# EAGLE schematic covox (EAGLE 7.3.0)
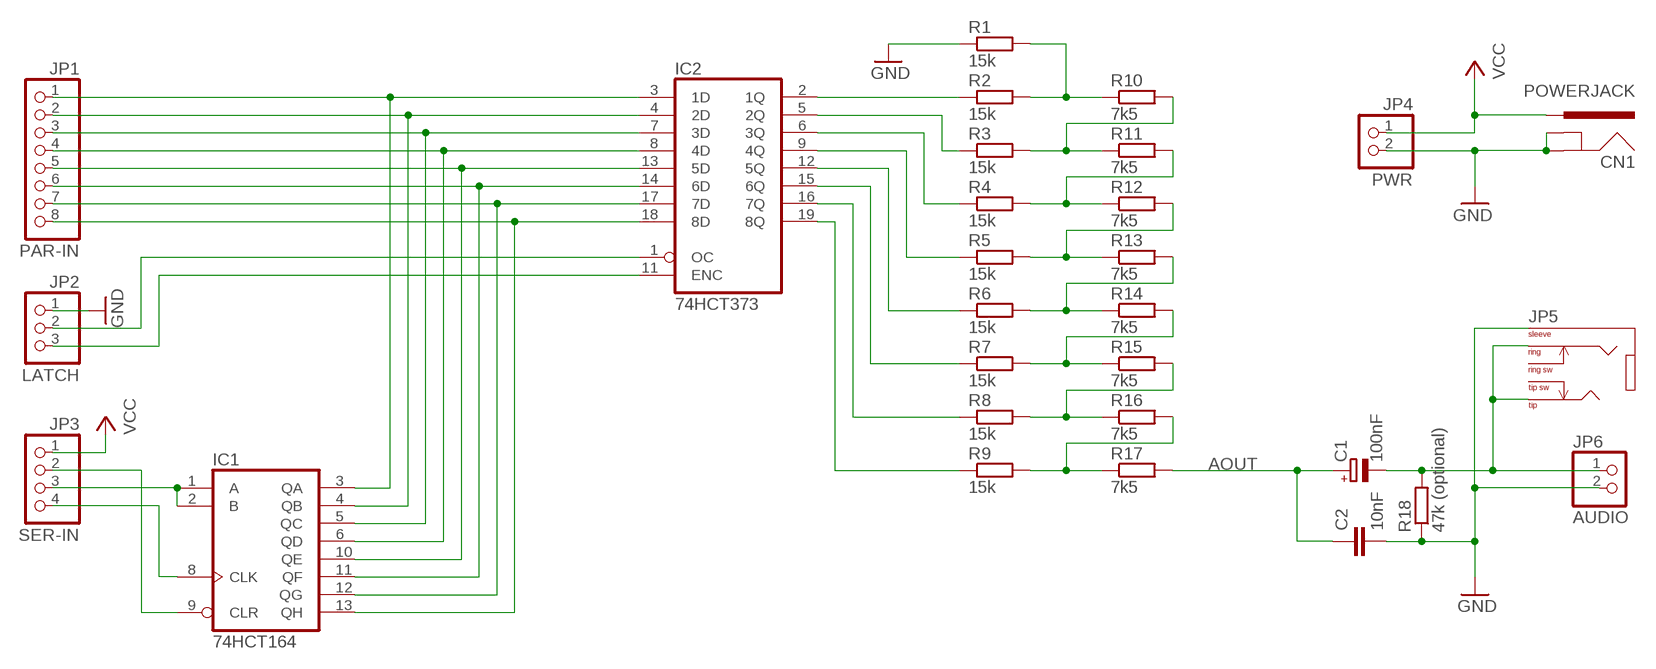
[diagram p0: schematic, sheet 1]

## Parts
C1  100nF  CPOL-EUE2-4  [E2-4]
C2  10nF  C-EU025-025X050  [C025-025X050]
CN1  POWERJACK  POWERJACK-SLOT  [POWERJACK_SLOT]
IC1  74HCT164  74HC164N  [DIL14]
IC2  74HCT373  74HCT373N  [DIL20]
JP1  PAR-IN  PINHD-1X8  [1X08]
JP2  LATCH  PINHD-1X3  [1X03]
JP3  SER-IN  PINHD-1X4  [1X04]
JP4  PWR  PINHD-1X2  [1X02]
JP5  AUDIO  AUDIO-JACK-3.5MM  [AUDIO-JACK-3.5MM]
JP6  AUDIO  PINHD-1X2  [1X02]
R1  15k  R-EU_0204/7  [0204/7]
R2  15k  R-EU_0204/7  [0204/7]
R3  15k  R-EU_0204/7  [0204/7]
R4  15k  R-EU_0204/7  [0204/7]
R5  15k  R-EU_0204/7  [0204/7]
R6  15k  R-EU_0204/7  [0204/7]
R7  15k  R-EU_0204/7  [0204/7]
R8  15k  R-EU_0204/7  [0204/7]
R9  15k  R-EU_0204/7  [0204/7]
R10  7k5  R-EU_0204/7  [0204/7]
R11  7k5  R-EU_0204/7  [0204/7]
R12  7k5  R-EU_0204/7  [0204/7]
R13  7k5  R-EU_0204/7  [0204/7]
R14  7k5  R-EU_0204/7  [0204/7]
R15  7k5  R-EU_0204/7  [0204/7]
R16  7k5  R-EU_0204/7  [0204/7]
R17  7k5  R-EU_0204/7  [0204/7]
R18  47k (optional)  R-EU_0204/7  [0204/7]

## Nets
AOUT: C1.+ C2.1 R17.2
GND [supply]: C2.2 CN1.GND CN1.GNDBREAK JP2.1 JP4.2 JP5.1 JP6.2 R1.1 R18.1
N$1: R1.2 R2.2 R10.1
N$2: R3.2 R10.2 R11.1
N$3: R4.2 R11.2 R12.1
N$4: R5.2 R12.2 R13.1
N$5: R6.2 R13.2 R14.1
N$6: R7.2 R14.2 R15.1
N$7: R8.2 R15.2 R16.1
N$8: IC2.2(1Q) R2.1
N$9: IC2.5(2Q) R3.1
N$10: IC2.6(3Q) R4.1
N$11: IC2.9(4Q) R5.1
N$12: IC2.12(5Q) R6.1
N$13: IC2.15(6Q) R7.1
N$14: IC2.16(7Q) R8.1
N$15: IC2.19(8Q) R9.1
N$16: IC1.1(A) IC1.2(B) JP3.3
N$17: R9.2 R16.2 R17.1
N$18: IC1.3(QA) IC2.3(1D) JP1.1
N$19: IC1.4(QB) IC2.4(2D) JP1.2
N$20: IC1.5(QC) IC2.7(3D) JP1.3
N$21: IC1.6(QD) IC2.8(4D) JP1.4
N$22: IC1.10(QE) IC2.13(5D) JP1.5
N$23: IC1.11(QF) IC2.14(6D) JP1.6
N$24: IC1.12(QG) IC2.17(7D) JP1.7
N$25: IC1.13(QH) IC2.18(8D) JP1.8
N$26: IC2.1(OC) JP2.2
N$27: IC2.11(ENC) JP2.3
N$30: IC1.9(CLR) JP3.2
N$31: IC1.8(CLK) JP3.4
N$32: C1.- JP5.2 JP5.3 JP6.1 R18.2
VCC [supply]: CN1.PWR JP3.1 JP4.1
Unconnected: JP5.4 JP5.5

## Power pins joined to a net without a drawn wire
GND: IC1.7(GND) IC2.10(GND)
VCC: IC1.14(VCC) IC2.20(VCC)

## Library data of the parts
C1 = rcl:CPOL-EU: POLARIZED CAPACITOR, European symbol
C2 = rcl:C-EU: CAPACITOR, European symbol
CN1 = KaiBader:POWERJACK: Power Jack Standard 2.1 mm * 5.5 mm barrel jack for power (e.g. Arduino).
IC1 = 74xx-eu:74*164: 8-bit parallel out SHIFT REGISTER
IC2 = 74xx-eu:74*373: Octal D type transparent LATCH, edge triggered
JP1 = pinhead:PINHD-1X8: PIN HEADER
JP2 = pinhead:PINHD-1X3: PIN HEADER
JP3 = pinhead:PINHD-1X4: PIN HEADER
JP4 JP6 = pinhead:PINHD-1X2: PIN HEADER
JP5 = KaiBader:AUDIO-JACK-3.5MM: 3.5mm Audio Jack SJ1-351X Series (SJ1-3513/SJ1-3514/SJ13515)
R1-R18 = rcl:R-EU_: RESISTOR, European symbol

## Net classes
0 default: width 0.305 mm, drill 0.508 mm, clearance 0.305 mm
1 supply: width 0.508 mm, drill 0.508 mm, clearance 0.305 mm